# Altium schematic sheet [06] - TEMP, HUM, CUR SENSORS.SchDoc
size A3; DocumentNumber: 6; SheetNumber: 6; SheetTotal: 14
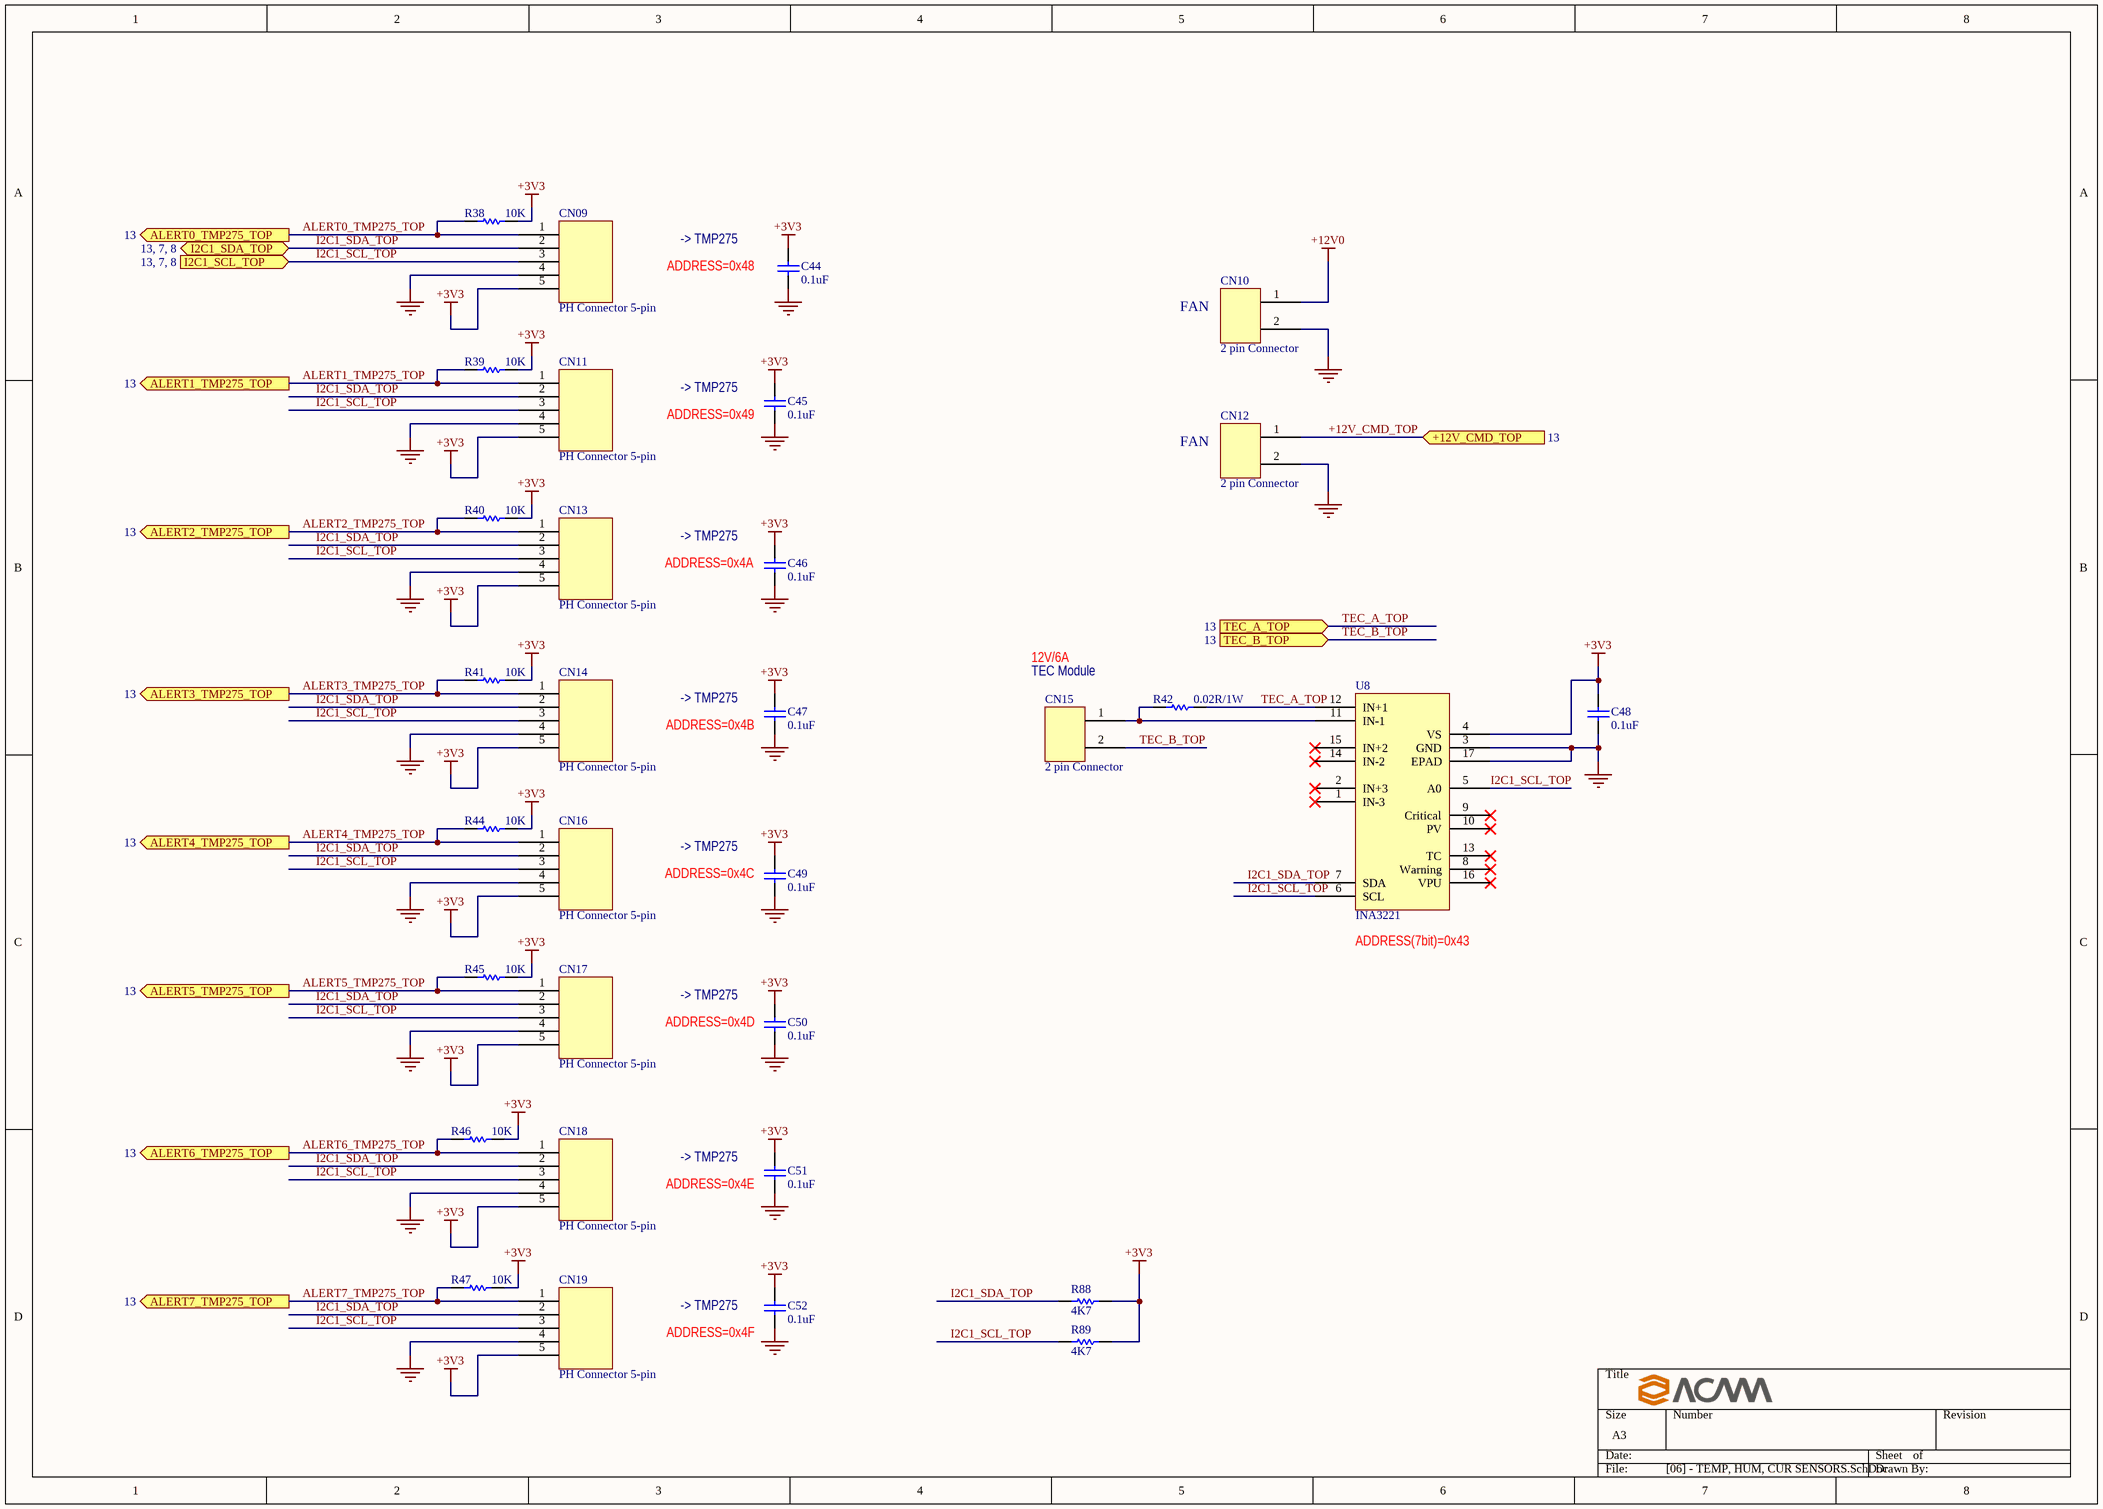
[diagram p0: [06] - TEMP, HUM, CUR SENSORS.SchDoc]

## Parts
C44  0.1uF  [0805_C_AUTO]
C45  0.1uF  [0805_C_AUTO]
C46  0.1uF  [0805_C_AUTO]
C47  0.1uF  [0805_C_AUTO]
C48  0.1uF  [0805_C_AUTO]
C49  0.1uF  [0805_C_AUTO]
C50  0.1uF  [0805_C_AUTO]
C51  0.1uF  [0805_C_AUTO]
C52  0.1uF  [0805_C_AUTO]
CN09  PH Connector 5-pin  [PH_5PIN]
CN10  2 pin Connector  [KF142R_CONN_2PIN]
CN11  PH Connector 5-pin  [PH_5PIN]
CN12  2 pin Connector  [KF142R_CONN_2PIN]
CN13  PH Connector 5-pin  [PH_5PIN]
CN14  PH Connector 5-pin  [PH_5PIN]
CN15  2 pin Connector  [KF142R_CONN_2PIN]
CN16  PH Connector 5-pin  [PH_5PIN]
CN17  PH Connector 5-pin  [PH_5PIN]
CN18  PH Connector 5-pin  [PH_5PIN]
CN19  PH Connector 5-pin  [PH_5PIN]
R38  10K  [0805_R_AUTO]
R39  10K  [0805_R_AUTO]
R40  10K  [0805_R_AUTO]
R41  10K  [0805_R_AUTO]
R42  0.02R/1W  [2512_R]
R44  10K  [0805_R_AUTO]
R45  10K  [0805_R_AUTO]
R46  10K  [0805_R_AUTO]
R47  10K  [0805_R_AUTO]
R88  4K7  [0805_R_AUTO]
R89  4K7  [0805_R_AUTO]
U8  INA3221  [QFN-16]

## Ports
+12V_CMD_TOP (in, see 13), ALERT0_TMP275_TOP (out, see 13), ALERT1_TMP275_TOP (out, see 13), ALERT2_TMP275_TOP (out, see 13), ALERT3_TMP275_TOP (out, see 13), ALERT4_TMP275_TOP (out, see 13), ALERT5_TMP275_TOP (out, see 13), ALERT6_TMP275_TOP (out, see 13), ALERT7_TMP275_TOP (out, see 13), I2C1_SCL_TOP (in, see 13, 7, 8), I2C1_SDA_TOP (bidir, see 13, 7, 8), TEC_A_TOP (in, see 13), TEC_B_TOP (in, see 13)

## Nets
+3V3: C44.2 C45.2 C46.2 C47.2 C48.2 C49.2 C50.2 C51.2 C52.2 CN09.5 CN11.5 CN13.5 CN14.5 CN16.5 CN17.5 CN18.5 CN19.5 R38.1 R39.1 R40.1 R41.1 R44.1 R45.1 R46.1 R47.1 R88.2 R89.2 U8.4(VS)
+12V0: CN10.1
GND: C44.1 C45.1 C46.1 C47.1 C48.1 C49.1 C50.1 C51.1 C52.1 CN09.4 CN10.2 CN11.4 CN12.2 CN13.4 CN14.4 CN16.4 CN17.4 CN18.4 CN19.4 U8.3(GND) U8.17(EPAD)
+12V_CMD_TOP: CN12.1 ; port +12V_CMD_TOP
ALERT0_TMP275_TOP: CN09.1 R38.2 ; port ALERT0_TMP275_TOP
ALERT1_TMP275_TOP: CN11.1 R39.2 ; port ALERT1_TMP275_TOP
ALERT2_TMP275_TOP: CN13.1 R40.2 ; port ALERT2_TMP275_TOP
ALERT3_TMP275_TOP: CN14.1 R41.2 ; port ALERT3_TMP275_TOP
ALERT4_TMP275_TOP: CN16.1 R44.2 ; port ALERT4_TMP275_TOP
ALERT5_TMP275_TOP: CN17.1 R45.2 ; port ALERT5_TMP275_TOP
ALERT6_TMP275_TOP: CN18.1 R46.2 ; port ALERT6_TMP275_TOP
ALERT7_TMP275_TOP: CN19.1 R47.2 ; port ALERT7_TMP275_TOP
I2C1_SCL_TOP: CN09.3 CN11.3 CN13.3 CN14.3 CN16.3 CN17.3 CN18.3 CN19.3 R89.1 U8.5(A0) U8.6(SCL) ; port I2C1_SCL_TOP
I2C1_SDA_TOP: CN09.2 CN11.2 CN13.2 CN14.2 CN16.2 CN17.2 CN18.2 CN19.2 R88.1 U8.7(SDA) ; port I2C1_SDA_TOP
TEC_A_TOP: R42.2 U8.12(IN+1) ; port TEC_A_TOP
TEC_B_TOP: CN15.2 ; port TEC_B_TOP
NetCN15_1: CN15.1 R42.1 U8.11(IN-1)

Not connected (* = marked no-connect by the designer): U8 1(IN-3)* 2(IN+3)* 8(Warning)* 9(Critical)* 10(PV)* 13(TC)* 14(IN-2)* 15(IN+2)* 16(VPU)*

## Notes on the sheet
- (near C44) -> TMP275
- (near C44) ADDRESS=0x48
- FAN
- (near C45) ADDRESS=0x49
- (near C45) -> TMP275
- (near C46) ADDRESS=0x4A
- (near C46) -> TMP275
- (near C47) -> TMP275
- (near CN15) TEC Module
- 12V/6A
- (near C47) ADDRESS=0x4B
- (near C49) -> TMP275
- (near C49) ADDRESS=0x4C
- (near U8) ADDRESS(7bit)=0x43
- (near C50) ADDRESS=0x4D
- (near C50) -> TMP275
- (near C51) ADDRESS=0x4E
- (near C51) -> TMP275
- (near C52) -> TMP275
- (near C52) ADDRESS=0x4F

## Library data of the parts
C44-C52 = Cap SMD: Non-Pol SMD Capacitor; RATED_VOLTAGE: 16V; Value: 0.1uF; Manufacturer Part Num: *
CN09 CN11 CN13 CN14 CN16-CN19 = PH Connector 5-pin: PH Connector , 5 pin, 2mm pitch, straight; Value: PH Connector 5-pin
CN10 CN12 CN15 = Connector Screwless 2 pin: KAIFENG Screwless Connector 2 pin; Manufacturer Part Num: KF142R; Value: 2 pin Connector
R38-R41 R44-R47 R88 R89 = Res SMD: SMD Resistor; Tolerance: 5%; Manufacturer Part Num: *
  R38-R41 R44-R47: Value: 10K
  R88 R89: Value: 4K7
R42 = Res SMD: SMD Resistor; Manufacturer Part Num: RL2512FK-070R02L; Tolerance: 1%; Value: 0.02R/1W
U8 = INA3221: INA3221 Triple-Channel, High-Side Measurement, / Shunt and Bus Voltage Monitor with I2C- and SMBUS-Compatible Interface; Manufacturer Part Num: INA3221AIRGVR; Value: INA3221